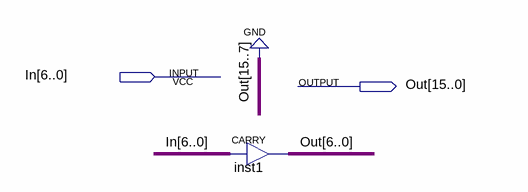
[diagram p0: schematic sheet]
// Quartus schematic SignExtend_7bit_to_16bit.bdf as structural Verilog: 1 symbols, 2 pins
module SignExtend_7bit_to_16bit (
  input  [6:0] In,
  output [15:0] Out
);

  CARRY inst1[6:0] (.IN(In), .OUT(Out[6:0]));

  assign Out[15:7] = {9{1'b0}};
endmodule
